# Altium schematic sheet P12 MIPI LCD.SchDoc
size 420 x 297 mm
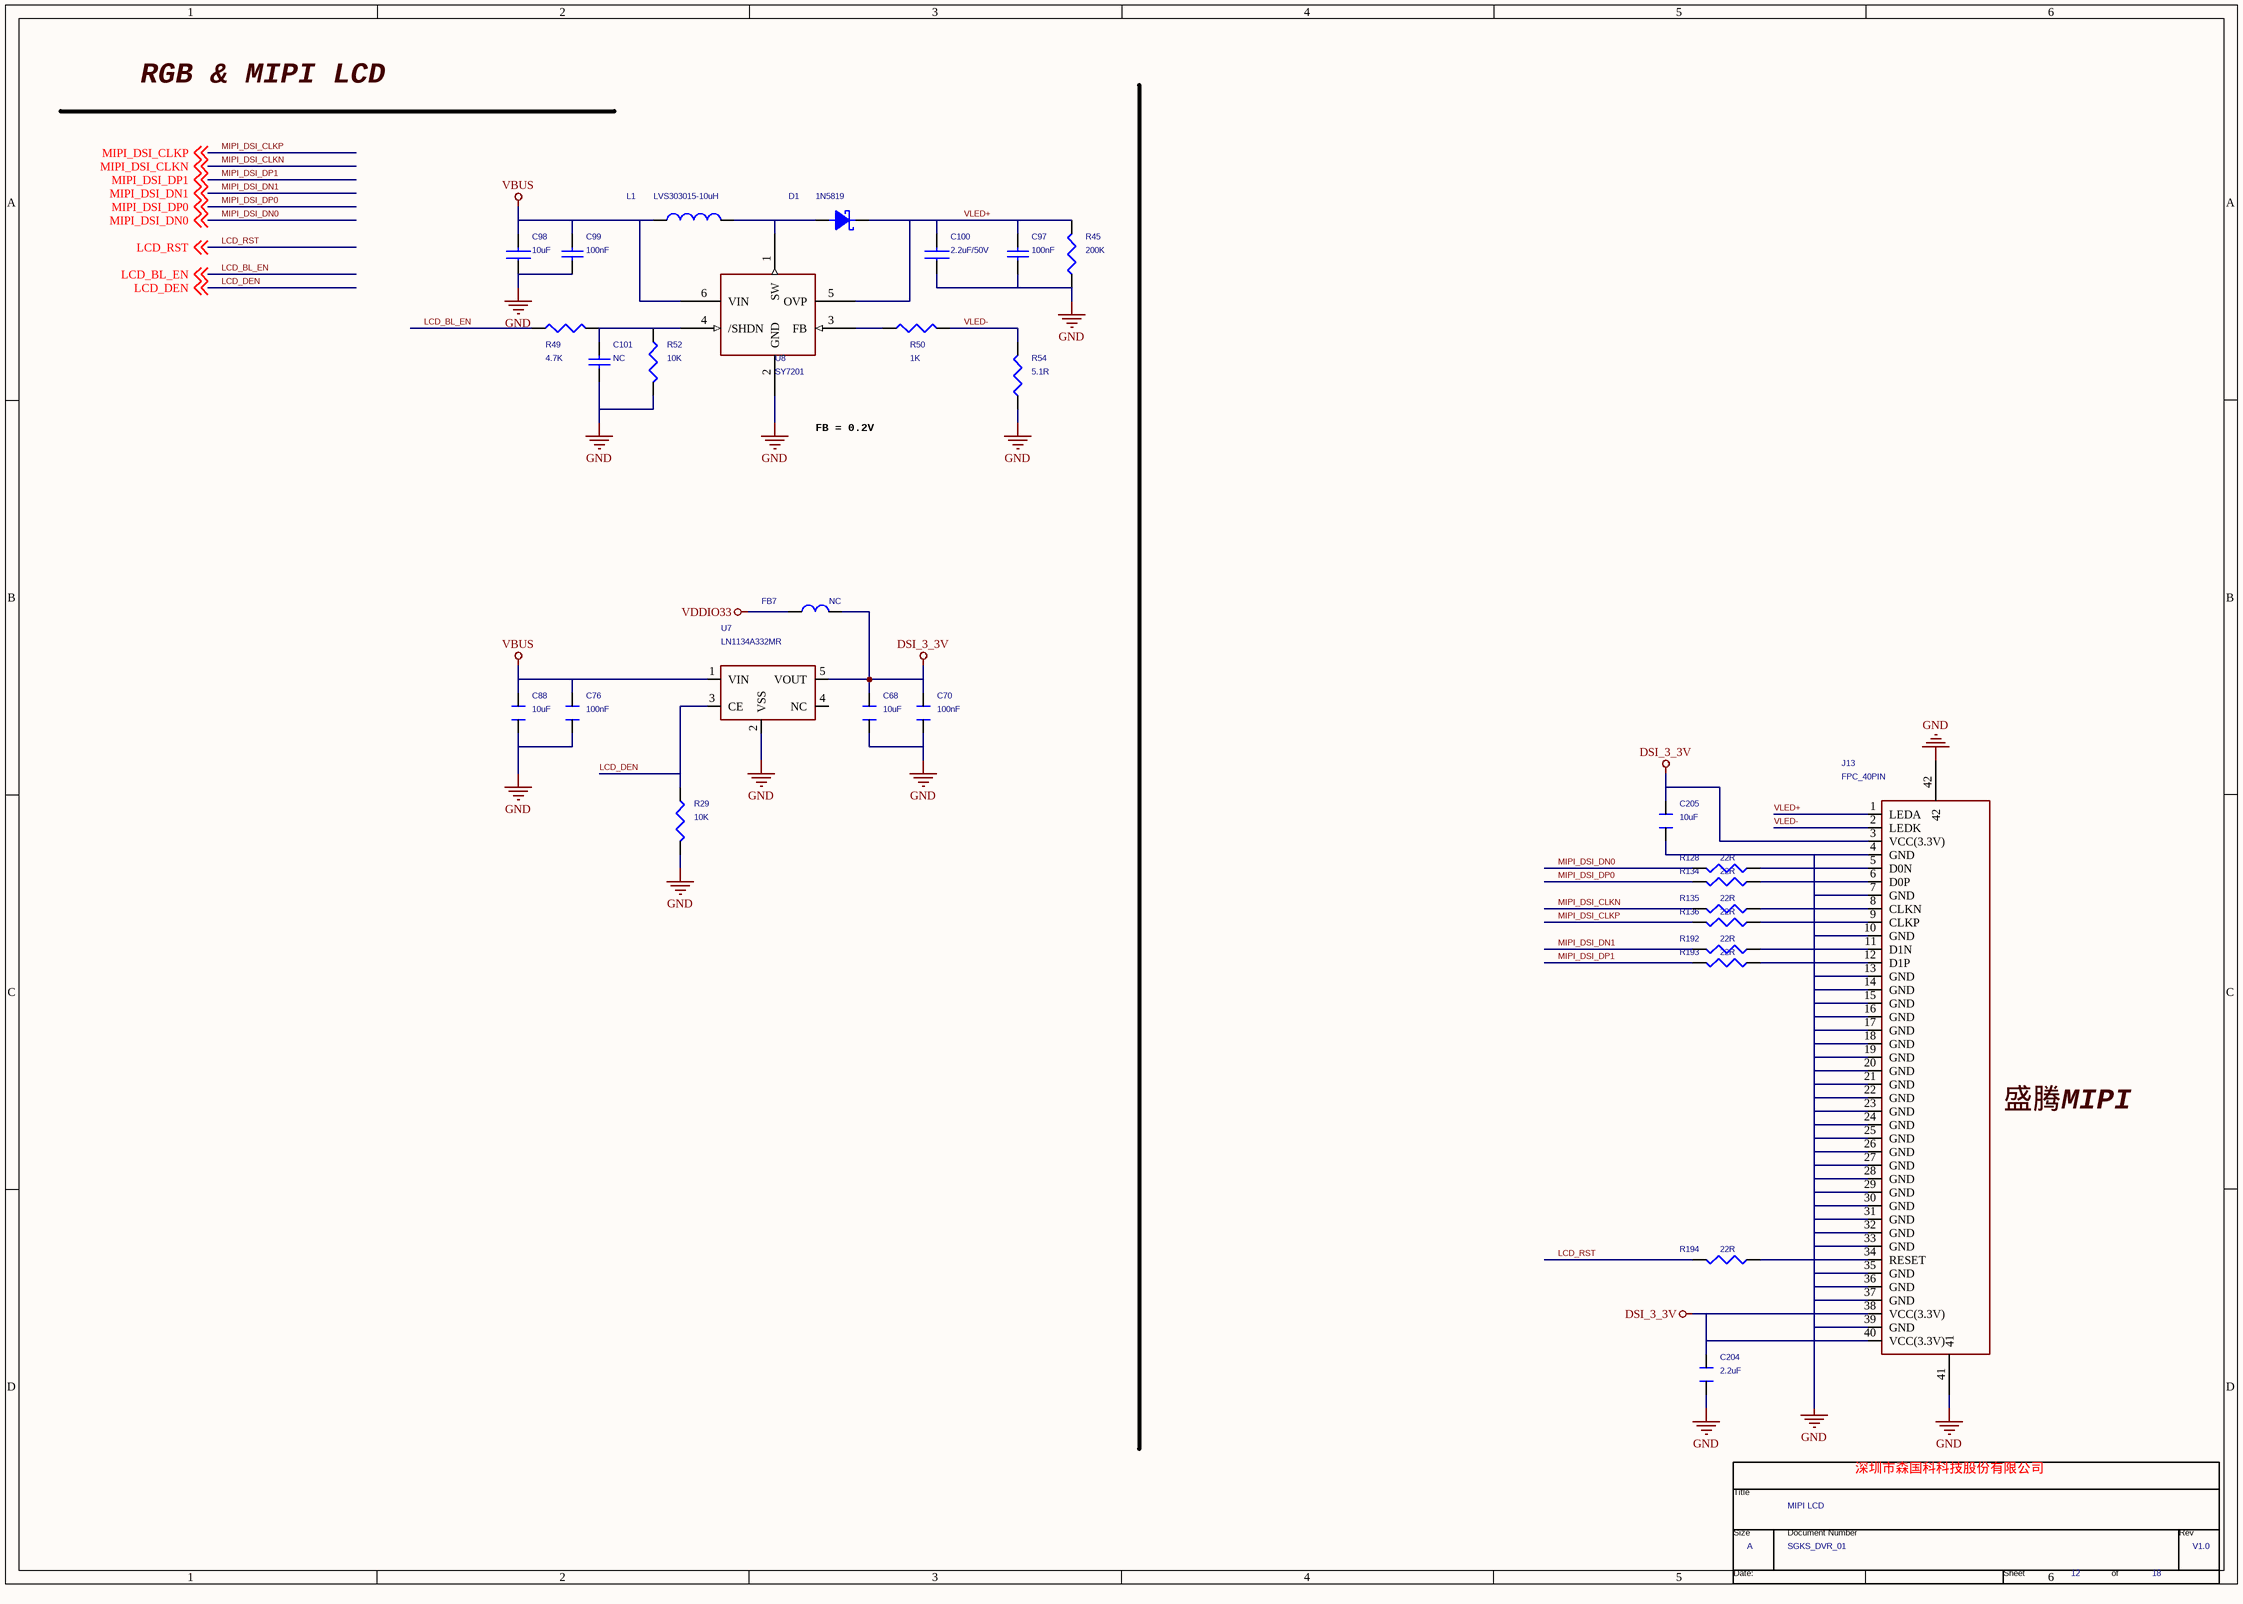
[diagram p0: P12 MIPI LCD.SchDoc]

## Parts
*  Page Count: 18  Page Number: 12  Page Size: A  Title: MIPI LCD  RevCode: V1.0  Doc: SGKS_DVR_01  (hidden comment: TitleBlock0)  (graphical)
C68  10uF  [C0603]
C70  100nF  [C0402]
C76  100nF  [C0402]
C88  10uF  [C0603]
C97  100nF  [C0402]
C98  10uF  [C0603]
C99  100nF  [C0402]
C100  2.2uF/50V  [C0603]
C101  NC  [C0402]
C204  2.2uF  [C0603]
C205  10uF  [C0603]
D1  1N5819  [SMD/1210D]
FB7  NC  [0805]
J13  FPC_40PIN  [FPC-40PIN-0.5MM]
L1  LVS303015-10uH  [PL4X4]
R29  10K  [R0603/SMD]
R45  200K  [R0402]
R49  4.7K  [R0603/SMD]
R50  1K  [R0603/SMD]
R52  10K  [R0603/SMD]
R54  5.1R  [R0603]
R128  22R  [R0603/SMD]
R134  22R  [R0603/SMD]
R135  22R  [R0603/SMD]
R136  22R  [R0603/SMD]
R192  22R  [R0603/SMD]
R193  22R  [R0603/SMD]
R194  22R  [R0603/SMD]
U7  LN1134A332MR  [SOT23-6]
U8  SY7201  [SOT-23-5]

## Nets
DSI_3_3V: C68.2 C70.2 C204.2 C205.2 FB7.2 J13.3(VCC(3.3V)) J13.38(VCC(3.3V)) J13.40(VCC(3.3V)) U7.5(VOUT)
GND: C68.1 C70.1 C76.1 C88.1 C97.2 C98.1 C99.2 C100.1 C101.2 C204.1 C205.1 J13.4(GND) J13.7(GND) J13.10(GND) J13.13(GND) J13.14(GND) J13.15(GND) J13.16(GND) J13.17(GND) J13.18(GND) J13.19(GND) J13.20(GND) J13.21(GND) J13.22(GND) J13.23(GND) J13.24(GND) J13.25(GND) J13.26(GND) J13.27(GND) J13.28(GND) J13.29(GND) J13.30(GND) J13.31(GND) J13.32(GND) J13.33(GND) J13.35(GND) J13.36(GND) J13.37(GND) J13.39(GND) J13.41 J13.42 R29.2 R45.1 R52.2 R54.1 U7.2(VSS) U8.2(GND)
VBUS: C76.2 C88.2 C98.2 C99.1 L1.2 U7.1(VIN) U8.6(VIN)
VDDIO33: FB7.1
LCD_BL_EN: R49.1 ; off-sheet LCD_BL_EN
LCD_DEN: R29.1 U7.3(CE) ; off-sheet LCD_DEN
LCD_RST: R194.2 ; off-sheet LCD_RST
MIPI_DSI_CLKN: R135.2 ; off-sheet MIPI_DSI_CLKN
MIPI_DSI_CLKP: R136.2 ; off-sheet MIPI_DSI_CLKP
MIPI_DSI_DN0: R128.2 ; off-sheet MIPI_DSI_DN0
MIPI_DSI_DN1: R192.2 ; off-sheet MIPI_DSI_DN1
MIPI_DSI_DP0: R134.2 ; off-sheet MIPI_DSI_DP0
MIPI_DSI_DP1: R193.2 ; off-sheet MIPI_DSI_DP1
VLED+: C97.1 C100.2 D1.2(CATHODE) J13.1(LEDA) R45.2 U8.5(OVP)
VLED-: J13.2(LEDK) R50.2 R54.2
NetC101_1: C101.1 R49.2 R52.1 U8.4(/SHDN)
NetD1_1: D1.1(ANODE) L1.1 U8.1(SW)
NetJ13_5: J13.5(D0N) R128.1
NetJ13_6: J13.6(D0P) R134.1
NetJ13_8: J13.8(CLKN) R135.1
NetJ13_9: J13.9(CLKP) R136.1
NetJ13_11: J13.11(D1N) R192.1
NetJ13_12: J13.12(D1P) R193.1
NetJ13_34: J13.34(RESET) R194.1
NetR50_1: R50.1 U8.3(FB)

Not connected (* = marked no-connect by the designer): U7 4(NC)

## Notes on the sheet
- RGB & MIPI LCD
- FB = 0.2V
- 盛腾MIPI
- 深圳市森国科科技股份有限公司
- (in symbol TitleBlock0) Title; Size; Document Number; Rev; Date:; Sheet; of

## Library data of the parts
C68 C70 C76 C88 C204 C205 = CAPACITOR: PAGE: 1
C97 C99 C101 = CAP/CB_0: Part Description: Chip Capacitor
C98 = CAP NP_0: CLASS: DISCRETE; DEVICE: 0_1u
C100 = CAP NP_1_Dup1: DEVICE: 0_1u; CLASS: DISCRETE
D1 = DIODE/SCHOTTKY
FB7 = Ferrite BEAD
J13 = CN30PIN_1
L1 = INDUCTOR_Dup1
R29 = RES/SMD_1: Part Description: Chip Resistor; Type: 贴片电阻
R45 R54 = RESISTOR_Dup2
R49 R50 R52 R128 R134-R136 R192-R194 = RES/SMD_0: Part Description: Chip Resistor
  R49 R50 R52: Type: 贴片电阻
U7 = RT9266PE_0
U8 = RT8008_0
* = TitleBlock0: Page Create Date: March  8, 1995